# EAGLE design charger_module (EAGLE 7.4.0)
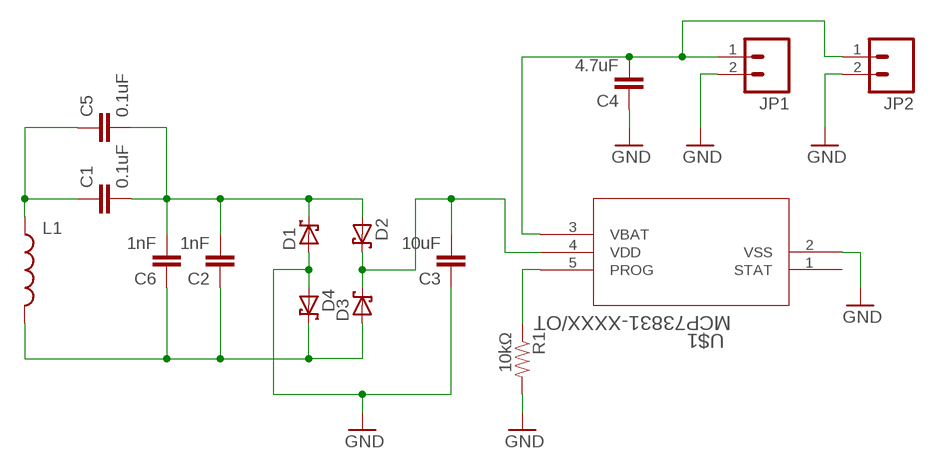
[diagram p0: schematic, sheet 1]

## Parts
C1  0.1uF  CAPPTH1  [CAP-PTH-5MM]
C2  1nF  CAPPTH1  [CAP-PTH-5MM]
C3  10uF  CAPPTH1  [CAP-PTH-5MM]
C4  4.7uF  CAPPTH1  [CAP-PTH-5MM]
C5  0.1uF  CAPPTH1  [CAP-PTH-5MM]
C6  1nF  CAPPTH1  [CAP-PTH-5MM]
D1  SCHOTTKY-DIODECB417-15  [CB417-15]
D2  SCHOTTKY-DIODECB417-15  [CB417-15]
D3  SCHOTTKY-DIODECB417-15  [CB417-15]
D4  SCHOTTKY-DIODECB417-15  [CB417-15]
JP1  M02PTH  [1X02]
JP2  M02PTH  [1X02]
L1  INDUCTORAXIAL-0.6  [AXIAL-0.6]
R1  10kΩ  RESISTORAXIAL-0.3  [AXIAL-0.3]
U$1  MCP73831-XXXX/OT  [SOT-23-5_MC]

## Nets
GND: C3.1 C4.1 D1.A D4.A JP1.2 JP2.2 R1.P$2 U$1.2(VSS)
N$1: C1.1 C5.1 L1.P$1
N$2: C1.2 C2.2 C5.2 C6.2 D1.C D2.A
N$4: C3.2 D2.C D3.C U$1.4(VDD)
N$5: C4.2 JP1.1 JP2.1 U$1.3(VBAT)
N$7: C2.1 C6.1 D3.A D4.C L1.P$2
N$8: R1.P$1 U$1.5(PROG)
Unconnected: U$1.1(STAT)

## Library data of the parts
C1-C6 = SparkFun-Passives:CAP: Capacitor Standard 0603 ceramic capacitor, and 0.1" leaded capacitor.
D1-D4 = diode:SCHOTTKY-DIODE: Schottky Diode
JP1 JP2 = SparkFun-Connectors:M02: Standard 2-pin 0.1" header. Use with - straight break away headers ( PRT-00116) - right angle break away headers (PRT-00553) - swiss pins (PRT-00743) - machine pins (PRT-00117) - female headers (PRT-00115) Molex polarized connector foot print use with: PRT-08233 with associated crimp pins and housings. 2.54_SCREWTERM for use with PRT-10571. 3.5mm Screw Terminal footprints for PRT-08084 5mm Screw Terminal footprints for use with PRT-08432
L1 = SparkFun-Passives:INDUCTOR: Inductors Basic Inductor/Choke - 0603 and 1206. Footprints are not proven and vary greatly between part numbers. INDUCTOR POWER 3.3UH 4.0A SMD 0.197" L x 0.197" W x 0.177" H (5.00mm x 5.00mm x 4.50mm)
R1 = SparkFun-Passives:RESISTOR: Resistor Basic schematic elements and footprints for 0603, 1206, and PTH resistors.
U$1 = MCP73831:MCP73831-XXXX/OT

## Board
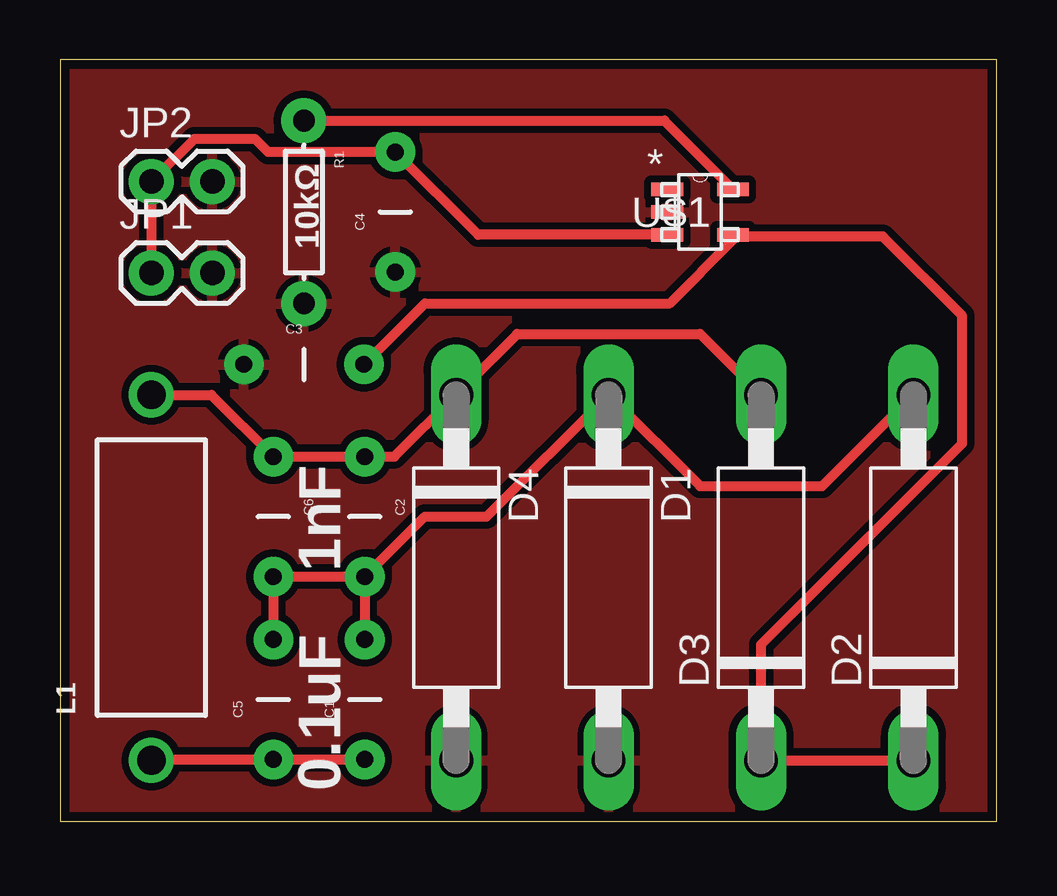
[diagram p1: board, top side]

Size 39.04 x 31.74 mm. Coordinates in mm from the lower left corner, seen from the top.
Outline: 0,0 39.04,0 39.04,31.74 0,31.74 0,0
Copper layers (1*16): Top 0.0356mm / dielectric 1.5011mm / Bottom 0.0356mm
Design rules "LaenPCBOrder": minimum track width 6mil, minimum drill 13mil, track to track 6mil, track to pad 6mil, pad to pad 6mil, via to via 6mil, smd to smd 6mil, copper to edge 15mil, drill to drill 6mil, minimum pad ring 7mil, minimum via ring 7mil, stop-mask expansion 3mil, vias tented up to drill 0mil, thermal gap 10mil

### Footprints (pad centres in the part's own frame; a part is rotated, then mirrored left to right if it is on the bottom)
CAP-PTH-5MM = drill 0.7 pad 1.651: 1 -2.5,0; 2 2.5,0
CB417-15 = drill 1.397 long: A 7.62,0; C -7.62,0
1X02 = drill 1.016 pad 1.88: 1 0,0; 2 2.54,0
AXIAL-0.6 = drill 1.2 pad 1.88: P$1 -7.62,0; P$2 7.62,0
AXIAL-0.3 = drill 0.9 pad 1.88: P$1 -3.81,0; P$2 3.81,0
SOT-23-5_MC = smd 1.321 x 0.559: 1 -1.371,0.95; 2 -1.371,0; 3 -1.371,-0.95; 4 1.371,-0.95; 5 1.371,0.95

### Placement (x,y rotation side)
C1  12.7,5.08 90 top
C2  12.7,12.7 270 top
C3  10.16,19.05 0 top
C4  13.97,25.4 90 top
C5  8.89,5.08 90 top
C6  8.89,12.7 270 top
D1  22.86,10.16 270 top
D2  35.56,10.16 90 top
D3  29.21,10.16 90 top
D4  16.51,10.16 270 top
JP1  3.81,22.86 0 top
JP2  3.81,26.67 0 top
L1  3.81,10.16 90 top
R1  10.16,25.4 270 top
U$1  26.67,25.4 0 top

### Tracks (layer width: path | path; a pad name or v marks a point on that pad's centre or on a via)
GND
  pour Top (isolate 0.305): 0,0 0,31.75 39.37,31.75 39.37,0
N$1
  Top 0.406: L1.P$1 3.85,2.58 C5.1 C1.1
N$2
  Top 0.406: D2.A 31.75,13.97 26.67,13.97 D1.C 17.78,12.7 15.2,12.7 C2.2 | C2.2 C1.2 | 8.89,10.16 C5.2 | C6.2 8.89,10.16 | 8.89,10.16 8.93,10.2 C2.2
N$4
  Top 0.406: D2.C D3.C 29.21,7.37 37.59,15.75 37.59,21.08 34.29,24.38 28.11,24.38 U$1.4 28.04,24.23 25.4,21.59 15.2,21.59 C3.2
N$5
  Top 0.406: JP1.1 JP2.1 5.59,28.45 8.13,28.45 8.68,27.9 C4.2 17.42,24.45 U$1.3
N$7
  Top 0.406: L1.P$2 6.31,17.78 C6.1 C2.1 13.93,15.2 D4.C 19.05,20.32 26.67,20.32 D3.A
N$8
  Top 0.406: R1.P$1 25.18,29.21 U$1.5

### Text on the board
tPlace: 1nF | 0.1uF